# Altium schematic sheet Micro_Conection.SchDoc (part 3 of 3)
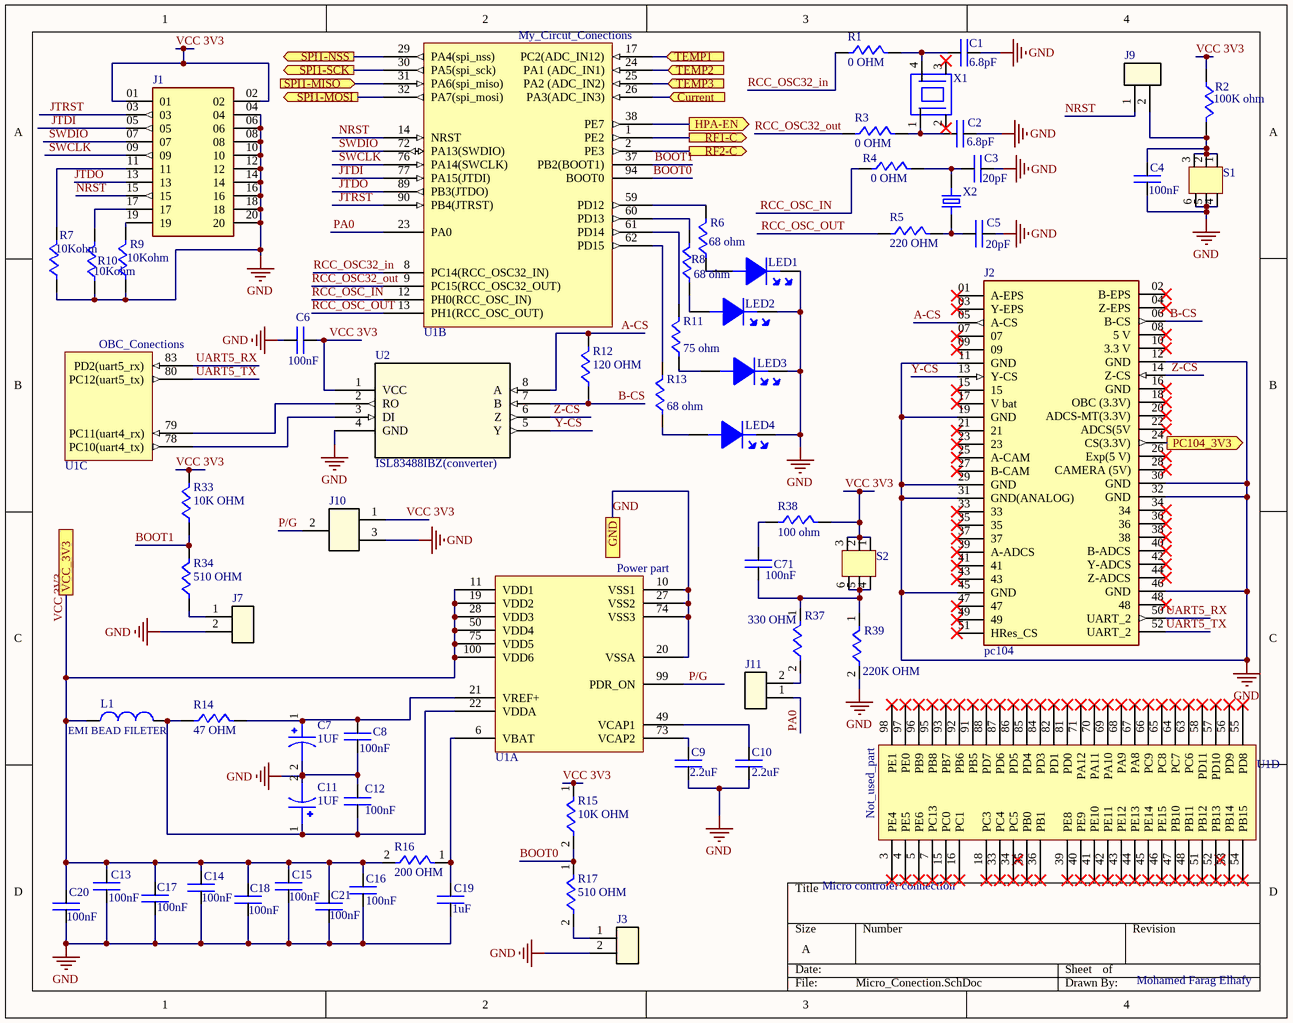
[diagram p2: Micro_Conection.SchDoc]

## Library data of the parts (continued)
R17 R34 = R_510ohm: 510 Ohms ±1% 0.125W, 1/8W Chip Resistor 0805 (2012 Metric)  Thick Film; Manufacturer: Panasonic; Manufacturer Part Number: ERJ-6ENF5100V; Voltage Rating: 150V; Power Rating: 125mW; Resistance: 510R; Temperature Coefficient: 100ppm/°C; Supplier 1: Digi-Key; RoHS: Yes; Stock 1: 208800; Pricing 1: 1 = 0.10000, 10 = 0.04500, 100 = 0.01820, 1000 = 0.00816, 2500 = 0.00708 (USD); Mount: Surface Mount; Case/Package: 0805; Case Code (Metric): 2012; Case Code (Imperial): 0805; Contact Plating: Tin; Weight: 0.000194oz; Min Operating Temperature: -55°C; Max Operating Temperature: 155°C; Tolerance: 1%; Packaging: Tape and Reel; Package Quantity: 5000; Resistor Type: Thick Film; Number of Terminations: 2; Termination: SMD/SMT; Max Power Dissipation: 125mW; Length: 2mm; Width: 0.049inch; Height: 0.028inch; Depth: 1.25mm; Radiation Hardening: No; REACH SVHC: No SVHC; Military Standard: Not; ComponentLink1URL: https://datasheet.ciiva.com/9181/aoa0000ce4-9181545.pdf?src-supplier=Avnet; ComponentLink1Description: https://datasheet.ciiva.com/9181/aoa0000ce4-9181545.pdf?src-supplier=Avnet; ComponentLink2URL: https://datasheet.ciiva.com/30096/aoa0000ce4-30096009.pdf?src-supplier=Onlinecomponents.com; ComponentLink2Description: https://datasheet.ciiva.com/30096/aoa0000ce4-30096009.pdf?src-supplier=Onlinecomponents.com; ComponentLink3URL: https://datasheet.ciiva.com/24041/aoa0000ce4-64075-24041195.pdf?src-supplier=Mouser; ComponentLink3Description: https://datasheet.ciiva.com/24041/aoa0000ce4-64075-24041195.pdf?src-supplier=Mouser; ComponentLink4URL: https://datasheet.ciiva.com/17205/aoa0000ce4-17205436.pdf?src-supplier=Avnet+Europe; ComponentLink4Description: https://datasheet.ciiva.com/17205/aoa0000ce4-17205436.pdf?src-supplier=Avnet+Europe; ComponentLink5URL: https://datasheet.ciiva.com/2530/eng-cd-1623243-ba-2530161.pdf?src-supplier=Digi-Key; ComponentLink5Description: https://datasheet.ciiva.com/2530/eng-cd-1623243-ba-2530161.pdf?src-supplier=Digi-Key; ComponentLink6URL: https://datasheet.ciiva.com/30065/eng-ds-1773204-e-30065884.pdf?src-supplier=Onlinecomponents.com; ComponentLink6Description: https://datasheet.ciiva.com/30065/eng-ds-1773204-e-30065884.pdf?src-supplier=Onlinecomponents.com; Supplier Part Number 1: A126372CT-ND; Voltage Rating (DC): 150V; Features: Automotive AEC-Q200; Series: ERJ; Construction: Rectangular; Lead Free: Lead Free; RoHS Compliant: Yes
R37 = R_330 ohm: 330 Ohms ±5% 0.5W, 1/2W Chip Resistor 0805 (2012 Metric) Automotive AEC-Q200, Pulse Withstanding Thick Film; Manufacturer: Panasonic; Manufacturer Part Number: ERJ-6ENF3300V; Voltage Rating: 150V; Resistance: 330R; Power Rating: 125mW; Tolerance: 1%; Temperature Coefficient: 100ppm/°C; RoHS: Yes; Mount: Surface Mount; Case/Package: 0805; Number of Pins: 2; Case Code (Imperial): 0805; Case Code (Metric): 2012; Contact Plating: Tin; Min Operating Temperature: -55°C; Max Operating Temperature: 155°C; Packaging: Tape and Reel; Package Quantity: 1; Resistor Type: Thick Film; Number of Terminations: 2; Termination: SMD/SMT; Max Power Dissipation: 125mW; Features: Automotive AEC-Q200; Length: 2mm; Width: 1.2mm; Height: 0.6mm; Depth: 1.25mm; Radiation Hardening: No; REACH SVHC: No SVHC; Military Standard: Not; Supplier 1: Digi-Key; Stock 1: 4895; Pricing 1: 1 = 0.10000, 10 = 0.09400, 100 = 0.03600, 1000 = 0.01584, 2500 = 0.01368 (USD); Voltage Rating (DC): 150V; Series: ERJ; Construction: Rectangular; Resistance Tolerance: 5%; Lead Free: Lead Free; RoHS Compliant: Yes; ComponentLink1URL: https://datasheet.ciiva.com/6139/aoa0000ce4-6139161.pdf?src-supplier=Farnell; ComponentLink1Description: https://datasheet.ciiva.com/6139/aoa0000ce4-6139161.pdf?src-supplier=Farnell; ComponentLink2URL: https://datasheet.ciiva.com/30243/aoa0000ce4-30243786.pdf?src-supplier=Onlinecomponents.com; ComponentLink2Description: https://datasheet.ciiva.com/30243/aoa0000ce4-30243786.pdf?src-supplier=Onlinecomponents.com; ComponentLink3URL: https://datasheet.ciiva.com/7887/aoa0000ce4-7887047.pdf?src-supplier=Element14; ComponentLink3Description: https://datasheet.ciiva.com/7887/aoa0000ce4-7887047.pdf?src-supplier=Element14
R38 = R_100 ohm: 100 Ohms ±5% 0.5W, 1/2W Chip Resistor 0805 (2012 Metric) Automotive AEC-Q200, Pulse Withstanding Thick Film; Manufacturer: Panasonic; Manufacturer Part Number: ERJ-P06J101V; Power Rating: 500mW; Voltage Rating: 400V; Temperature Coefficient: 200ppm/°C; Voltage Rating (DC): 150V; Supplier 1: Digi-Key; RoHS: Yes; Stock 1: 54556; Pricing 1: 1 = 0.11000, 10 = 0.10300, 100 = 0.03960, 1000 = 0.01742, 2500 = 0.01505 (USD); Mount: Surface Mount; Case/Package: 0805; Case Code (Imperial): 0805; Case Code (Metric): 2012; Weight: 0.000194oz; Contact Plating: Tin; Min Operating Temperature: -55°C; Max Operating Temperature: 155°C; Tolerance: 5%; Packaging: Tape and Reel; Package Quantity: 1; Resistor Type: Thick Film; Termination: SMD/SMT; Number of Terminations: 2; Max Power Dissipation: 500mW; Features: Automotive AEC-Q200; Series: ERJ; Resistance Tolerance: 5%; Construction: Rectangular; Technology: THICK FILM; Length: 2mm; Width: 1.2mm; Height: 0.6mm; Depth: 1.25mm; REACH SVHC: Unknown; Military Standard: Not; Lead Free: Lead Free; RoHS Compliant: Yes; ComponentLink1URL: https://datasheet.ciiva.com/11810/0900766b812cb812-11810156.pdf?src-supplier=RSComponents; ComponentLink1Description: https://datasheet.ciiva.com/11810/0900766b812cb812-11810156.pdf?src-supplier=RSComponents; ComponentLink2URL: https://datasheet.ciiva.com/16788/70068906-16788678.pdf?src-supplier=Allied+Electronics; ComponentLink2Description: https://datasheet.ciiva.com/16788/70068906-16788678.pdf?src-supplier=Allied+Electronics; ComponentLink3URL: https://datasheet.ciiva.com/24163/aoa0000ce4-64075-24163318.pdf?src-supplier=Mouser; ComponentLink3Description: https://datasheet.ciiva.com/24163/aoa0000ce4-64075-24163318.pdf?src-supplier=Mouser; ComponentLink4URL: https://datasheet.ciiva.com/7831/aoa0000ce4-7831000.pdf?src-supplier=Element14; ComponentLink4Description: https://datasheet.ciiva.com/7831/aoa0000ce4-7831000.pdf?src-supplier=Element14; ComponentLink5URL: https://datasheet.ciiva.com/17208/aoa0000ce4-17208010.pdf?src-supplier=Avnet+Europe; ComponentLink5Description: https://datasheet.ciiva.com/17208/aoa0000ce4-17208010.pdf?src-supplier=Avnet+Europe; ComponentLink6URL: https://datasheet.ciiva.com/9186/aoa0000ce4-9186844.pdf?src-supplier=Avnet; ComponentLink6Description: https://datasheet.ciiva.com/9186/aoa0000ce4-9186844.pdf?src-supplier=Avnet; ComponentLink7URL: https://datasheet.ciiva.com/16767/70068906-16767564.pdf?src-supplier=Allied+Electronics; ComponentLink7Description: https://datasheet.ciiva.com/16767/70068906-16767564.pdf?src-supplier=Allied+Electronics; Supplier Part Number 1: P100ADCT-ND
R39 = R_220 k: 220 kOhms ±5% 0.5W, 1/2W Chip Resistor 0805 (2012 Metric) Automotive AEC-Q200, Pulse Withstanding Thick Film; Manufacturer: Vishay; Manufacturer Part Number: CRCW0805220KFKEAC; Resistance: 220kR; Power Rating: 330mW; Voltage Rating: 150V; Temperature Coefficient: 200ppm/°C; Max Power Dissipation: 333mW; RoHS: No; Case/Package: 0805; Weight: 0.000194oz; Case Code (Imperial): 0805; Case Code (Metric): 2012; Contact Plating: Tin; Min Operating Temperature: -55°C; Max Operating Temperature: 155°C; Packaging: Tape and Reel; Tolerance: 5%; Package Quantity: 1; Termination: SMD/SMT; Resistor Type: Thick Film; Number of Terminations: 2; Features: Automotive AEC-Q200; Series: CRCW-HP; Length: 0.079inch; Width: 1.2mm; Height: 0.024inch; Radiation Hardening: No; Lead Free: Lead Free; RoHS Compliant: Yes; ComponentLink1URL: https://datasheet.ciiva.com/5542/crcwhpe3-46056-5542231.pdf?src-supplier=Mouser; ComponentLink1Description: https://datasheet.ciiva.com/5542/crcwhpe3-46056-5542231.pdf?src-supplier=Mouser; ComponentLink2URL: https://datasheet.ciiva.com/2474/crcwhpe3-2474653.pdf?src-supplier=Digi-Key; ComponentLink2Description: https://datasheet.ciiva.com/2474/crcwhpe3-2474653.pdf?src-supplier=Digi-Key; ComponentLink3URL: https://datasheet.ciiva.com/2474/crcwhpe3-2474654.pdf?src-supplier=Digi-Key; ComponentLink3Description: https://datasheet.ciiva.com/2474/crcwhpe3-2474654.pdf?src-supplier=Digi-Key; ComponentLink4URL: https://datasheet.ciiva.com/2474/crcwhpe3-2474655.pdf?src-supplier=Digi-Key; ComponentLink4Description: https://datasheet.ciiva.com/2474/crcwhpe3-2474655.pdf?src-supplier=Digi-Key; Supplier 1: Digi-Key; Stock 1: 11065; Pricing 1: 1 = 0.21000, 10 = 0.17600, 100 = 0.06880, 1000 = 0.02880, 2500 = 0.02640 (USD)
S1 S2 = push button: Pushbutton Switches 2 Poles Vertical .2A 14V 1.7mm Travel; Manufacturer: Alps Electric; Manufacturer Part Number: SPEJ110100; Mechanical Life: 10000Cycles; Current Rating: 200mA; Throw Configuration: DPDT; Contact Resistance: 150mR; Illumination Type: Illuminated; Actuator Length: 2.05mm; ComponentLink1Description: datasheet; ComponentLink1URL: https://eu.mouser.com/datasheet/2/15/SPEJ-1370905.pdf; Supplier 1: Mouser; RoHS: Yes; Stock 1: 202; Pricing 1: 1 = 2.45000, 10 = 2.45000, 50 = 2.06000, 100 = 2.02000, 1000 = 1.81000, 10000 = 1.81000 (USD); Mount: Surface Mount; Case/Package: SMD/SMT; Min Operating Temperature: -40°C; Max Operating Temperature: 85°C; Packaging: Tape and Reel; Voltage Rating (DC): 14V; Max Voltage Rating (DC): 14V; Orientation: Straight; Termination: Gull Wing; Radiation Hardening: No; ComponentLink2URL: https://datasheet.ciiva.com/16197/spej-16197423.pdf?src-supplier=Onlinecomponents.com; ComponentLink2Description: https://datasheet.ciiva.com/16197/spej-16197423.pdf?src-supplier=Onlinecomponents.com; ComponentLink3URL: https://datasheet.ciiva.com/18233/getdatasheetpartid-652615-18233247.pdf?src-supplier=Verical; ComponentLink3Description: https://datasheet.ciiva.com/18233/getdatasheetpartid-652615-18233247.pdf?src-supplier=Verical; Supplier Part Number 1: 688-SPEJ110100
U1 = STM32F407VGT6_1: ARM® Cortex®-M4 STM32F4 Microcontroller IC 32-Bit 168MHz 1MB (1M x 8) FLASH 100-LQFP (14x14)
X1 = MC-146 32.7680KA-E3: ROHS: 32.768kHz ±20ppm Crystal 6pF 65 kOhm -40°C ~ 85°C  Surface Mount 4-SMD, J-Lead; Manufacturer: Epson; ESR (Equivalent Series Resistance): 65kR; Supplier 1: Digi-Key; Manufacturer Part Number: MC-146 32.7680KA-E3: ROHS; RoHS: Yes; Stock 1: 980; Pricing 1: 1 = 0.36000, 10 = 0.30000, 50 = 0.27000, 100 = 0.24000 (USD); Mount: Surface Mount; Case/Package: SMD/SMT; Min Operating Temperature: -40°C; Max Operating Temperature: 85°C; Packaging: Tape and Reel; Frequency: 32.768kHz; Load Capacitance: 6pF; Frequency Tolerance: 20ppm; Length: 0.264inch; Width: 0.059inch; Height: 0.055inch; ComponentLink1URL: https://support.epson.biz/td/api/doc_check.php?dl=brief_MC-156_en.pdf&src-supplier=Digi-Key; ComponentLink1Description: https://support.epson.biz/td/api/doc_check.php?dl=brief_MC-156_en.pdf&src-supplier=Digi-Key; Supplier Part Number 1: SER4121CT-ND
X2 = ECS-80-32-5PX-TR: 8MHz Â±30ppm Crystal 32pF 60 Ohms HC-49/US; Manufacturer: ECS International; MF: ECS Inc.; Tolerance: 30ppm; ESR (Equivalent Series Resistance): 60R; Frequency Stability: 50ppm; Digi-Key_Purchase_URL: https://www.digikey.ru/product-detail/en/ecs-inc/ECS-80-32-5PX-TR/XC1272CT-ND/827736?utm_source=snapeda&utm_medium=aggregator&utm_campaign=symbol; Value: *; Digi-Key_Part_Number: XC1272CT-ND; Package: HC49/US ECS International; MP: ECS-80-32-5PX-TR; SnapEDA_Link: https://www.snapeda.com/parts/ECS-80-32-5PX-TR/ECS%20Inc./view-part/903429/?ref=snap; Supplier 1: Digi-Key; Manufacturer Part Number: ECS-80-32-5PX-TR; RoHS: Yes; Stock 1: 3024; Pricing 1: 1 = 0.45000, 10 = 0.37500, 50 = 0.33760, 100 = 0.30000, 500 = 0.28500 (USD); Mount: Surface Mount; Min Operating Temperature: -10°C; Max Operating Temperature: 70°C; Frequency: 8MHz; Package Quantity: 1000; Load Capacitance: 32pF; Packaging: Tape and Reel; Frequency Tolerance: 30ppm; Termination: SMD/SMT; Length: 0.449inch; Width: 4.8mm; Height: 0.169inch; Lead Free: Lead Free; ComponentLink1URL: https://datasheet.ciiva.com/852/csm-7x-852413.pdf?src-supplier=Digi-Key; ComponentLink1Description: https://datasheet.ciiva.com/852/csm-7x-852413.pdf?src-supplier=Digi-Key; ComponentLink2URL: https://datasheet.ciiva.com/852/csm-7x-852414.pdf?src-supplier=Digi-Key; ComponentLink2Description: https://datasheet.ciiva.com/852/csm-7x-852414.pdf?src-supplier=Digi-Key; ComponentLink3URL: https://datasheet.ciiva.com/852/csm-7x-852415.pdf?src-supplier=Digi-Key; ComponentLink3Description: https://datasheet.ciiva.com/852/csm-7x-852415.pdf?src-supplier=Digi-Key; Supplier Part Number 1: XC1272CT-ND
J2 = pc104: Supplier 1: Digi-Key; Supplier Part Number 1: SAM11115-ND
U2 = ISL83488IBZ(converter): Supplier 1: Arrow Electronics; Supplier Part Number 1: ISL83488IBZ